# Altium schematic sheet top level.SchDoc: Top Level
size 419 x 297 mm; Address6: Project_Address6; CompanyName: NOT USED; DocumentNumber: 1; SheetNumber: 1; SheetTotal: 22; PageSetup: Record=PageOptions|CenterHorizontal=True|CenterVertical=True|PrintScale=1.00|XCorrection=1.00|YCorrection=1.00|PrintKind=0|BorderSize=5000000|LeftOffset=0|BottomOffset=0|Orientation=2|PaperLength=1000|PaperWidth=1000|Scale=100|PaperSource=7|PrintQuality=-4|MediaType=1|DitherType=10|PaperKind=A3|PrintScaleMode=0
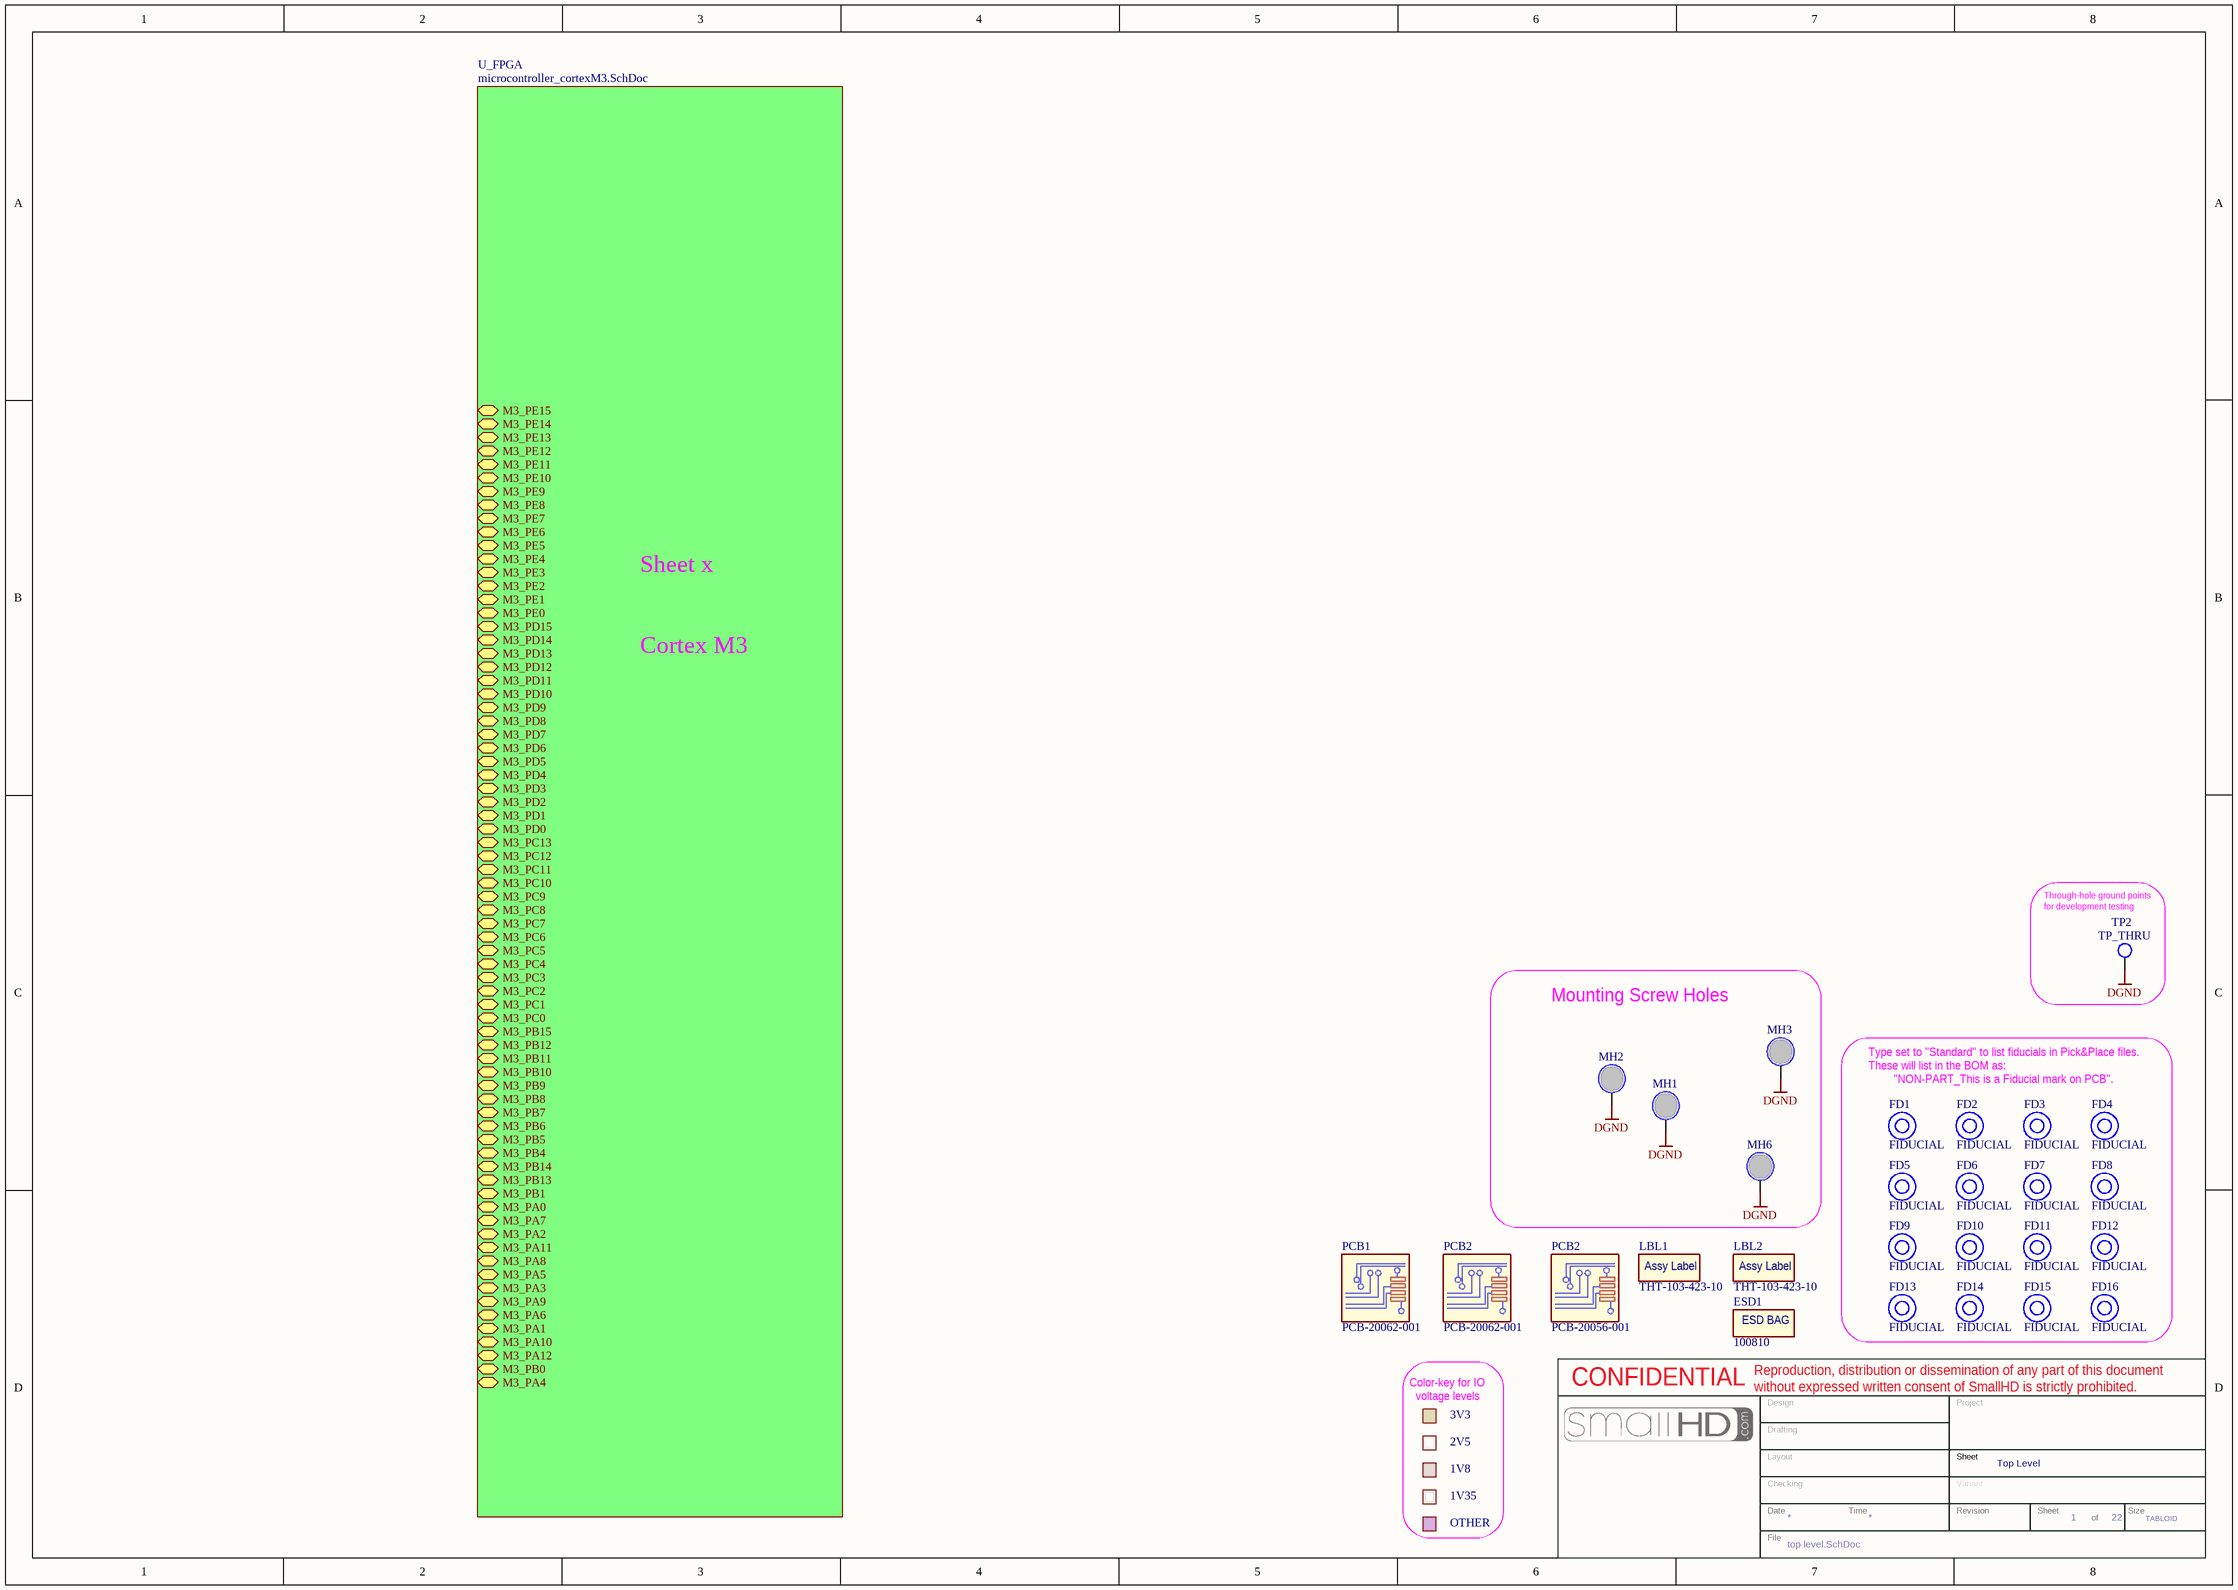
[diagram p0: top level.SchDoc]

## Parts
(Parts that share a designator on the sheet are numbered #1, #2 ... from top to bottom, then left to right.)
ESD1  100810  (mechanical)
FD1  FIDUCIAL  [FID10X20]
FD2  FIDUCIAL  [FID10X20]
FD3  FIDUCIAL  [FID10X20]
FD4  FIDUCIAL  [FID10X20]
FD5  FIDUCIAL  [FID10X20]
FD6  FIDUCIAL  [FID10X20]
FD7  FIDUCIAL  [FID10X20]
FD8  FIDUCIAL  [FID10X20]
FD9  FIDUCIAL  [FID10X20]
FD10  FIDUCIAL  [FID10X20]
FD11  FIDUCIAL  [FID10X20]
FD12  FIDUCIAL  [FID10X20]
FD13  FIDUCIAL  [FID10X20]
FD14  FIDUCIAL  [FID10X20]
FD15  FIDUCIAL  [FID10X20]
FD16  FIDUCIAL  [FID10X20]
LBL1  THT-103-423-10  [Assembly_Label_LBL1]
LBL2  THT-103-423-10  [Assembly_Label_LBL2]
MH1  SCREW-HOLE  [M3_buttonhead_hex]  (value not drawn)  (no BOM)
MH2  SCREW-HOLE  [M3_buttonhead_hex]  (value not drawn)  (no BOM)
MH3  SCREW-HOLE  [M3_buttonhead_hex]  (value not drawn)  (no BOM)
MH6  SCREW-HOLE  [M3_buttonhead_hex]  (value not drawn)  (no BOM)
PCB1  PCB-20062-001  [LOGO_SmallHD_4]
PCB2#1  PCB-20062-001  [LOGO_SmallHD_4]  (no BOM)
PCB2#2  PCB-20056-001  [LOGO_SmallHD_4]  (no BOM)
TP2  TP_THRU  [TP_THRU_1]  (no BOM)

## Sub-sheets
U_FPGA = microcontroller_cortexM3.SchDoc: M3_PE15 (bidir), M3_PE14 (bidir), M3_PE13 (bidir), M3_PE12 (bidir), M3_PE11 (bidir), M3_PE10 (bidir), M3_PE9 (bidir), M3_PE8 (bidir), M3_PE7 (bidir), M3_PE6 (bidir), M3_PE5 (bidir), M3_PE4 (bidir), M3_PE3 (bidir), M3_PE2 (bidir), M3_PE1 (bidir), M3_PE0 (bidir), M3_PD15 (bidir), M3_PD14 (bidir), M3_PD13 (bidir), M3_PD12 (bidir), M3_PD11 (bidir), M3_PD10 (bidir), M3_PD9 (bidir), M3_PD8 (bidir), M3_PD7 (bidir), M3_PD6 (bidir), M3_PD5 (bidir), M3_PD4 (bidir), M3_PD3 (bidir), M3_PD2 (bidir), M3_PD1 (bidir), M3_PD0 (bidir), M3_PC13 (bidir), M3_PC12 (bidir), M3_PC11 (bidir), M3_PC10 (bidir), M3_PC9 (bidir), M3_PC8 (bidir), M3_PC7 (bidir), M3_PC6 (bidir), M3_PC5 (bidir), M3_PC4 (bidir), M3_PC3 (bidir), M3_PC2 (bidir), M3_PC1 (bidir), M3_PC0 (bidir), M3_PB15 (bidir), M3_PB12 (bidir), M3_PB11 (bidir), M3_PB10 (bidir), M3_PB9 (bidir), M3_PB8 (bidir), M3_PB7 (bidir), M3_PB6 (bidir), M3_PB5 (bidir), M3_PB4 (bidir), M3_PB14 (bidir), M3_PB13 (bidir), M3_PB1 (bidir), M3_PA0 (bidir), M3_PA7 (bidir), M3_PA2 (bidir), M3_PA11 (bidir), M3_PA8 (bidir), M3_PA5 (bidir), M3_PA3 (bidir), M3_PA9 (bidir), M3_PA6 (bidir), M3_PA1 (bidir), M3_PA10 (bidir), M3_PA12 (bidir), M3_PB0 (bidir), M3_PA4 (bidir)  | 1: Sheet x; 4: Cortex M3

## Nets
DGND: MH1.1 MH2.1 MH3.1 MH6.1 TP2.1

Not connected (* = marked no-connect by the designer): FD1 0; FD2 0; FD3 0; FD4 0; FD5 0; FD6 0; FD7 0; FD8 0; FD9 0; FD10 0; FD11 0; FD12 0; FD13 0; FD14 0; FD15 0; FD16 0

## Notes on the sheet
- (near TP2) Through-hole ground points
  for development testing
- Mounting Screw Holes
- Type set to "Standard" to list fiducials in Pick&Place files.
  These will list in the BOM as:
  "NON-PART_This is a Fiducial mark on PCB".
- Color-key for IO
  voltage levels
- 3V3
- 2V5
- 1V8
- OTHER
- 1V35
- CONFIDENTIAL
- Reproduction, distribution or dissemination of any part of this document without expressed written consent of SmallHD is strictly prohibited.
- Design
- Project
- Drafting
- Layout
- Sheet
- Date
- File
- Checking
- Time
- Variant
- Revision
- of
- Size
- TABLOID
- (in symbol ESD-20001-001) ESD BAG
- (in symbol LBL-20002-001) Assy Label
- (in symbol LBL-20003-001) Assy Label

## Library data of the parts
ESD1 = ESD-20001-001: BAG STATIC METL-IN 8X10" OPEN TOP; Manufacturer: SCS; Display_Name: 100810; Schematic Symbol: ESDBAG_1; smallHD PN: ESD-20001-001; Manufacturer Part Number: 100810
FD1-FD16 = NPT-20003-001: NON-PART_This is a Fiducial mark on PCB; Display_Name: FIDUCIAL; Schematic Symbol: FIDUCIAL_BOMandPick&Place; smallHD PN: NPT-20003-001
LBL1 = LBL-20002-001: LABEL 1.0 x 0.25 inch Thermal polyester; Manufacturer: Brady; Display_Name: THT-103-423-10; smallHD PN: LBL-20002-001; Manufacturer Part Number: THT-103-423-10
LBL2 = LBL-20003-001: LABEL 1.0 x 0.25 inch Thermal polyester; Manufacturer: Brady; Display_Name: THT-103-423-10; smallHD PN: LBL-20003-001; Manufacturer Part Number: THT-103-423-10
MH1-MH3 MH6 = NPT-20017-001: M3 x 0.5 mm Button-Head Socket Cap Screw 2 mm Hex; Display_Name: SCREW-HOLE; smallHD PN: NPT-20017-001; Display Footprint: M3_buttonhead_hex
PCB1 PCB2#1 = PCB-20062-001: PCB Jeep REV 001; Manufacturer: PCB FAB; Schematic Symbol: PCB_1; smallHD PN: PCB-20062-001; Manufacturer Part Number: PCB-20062-001; Display_Name: PCB-20062-001
PCB2#2 = PCB-20056-001: PCB Fiesta-5W SDI MAIN REV 001; Manufacturer: PCB FAB; Schematic Symbol: PCB_1; smallHD PN: PCB-20056-001; Manufacturer Part Number: PCB-20056-001; Display_Name: PCB-20056-001
TP2 = NPT-20014-001: Test Point - THRU; Display_Name: TP_THRU; Schematic Symbol: TP_1; smallHD PN: NPT-20014-001; Display Footprint: TP_THRU